# Altium schematic sheet MEMORY.SchDoc
size A3; Author: HamidFijani; DrawnBy: HamidFijani; SheetNumber: 8; SheetTotal: 13
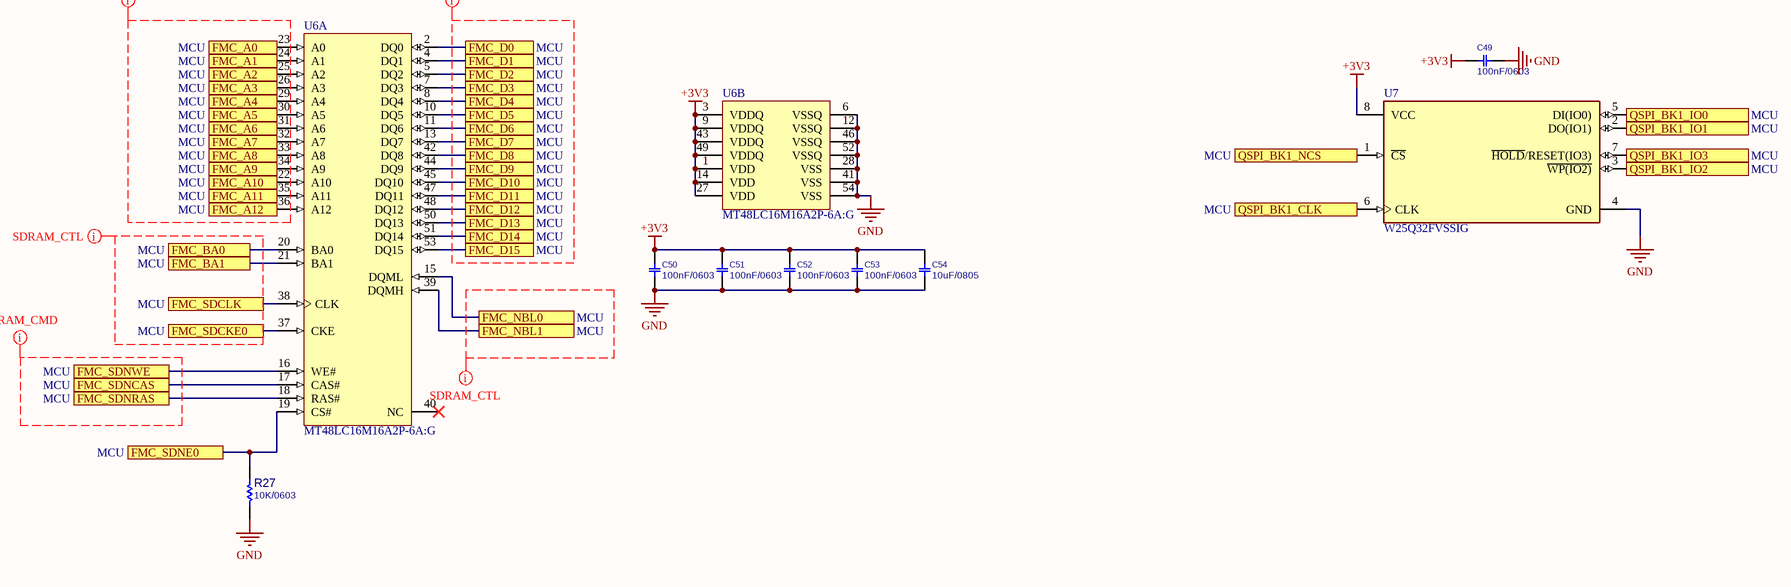
[diagram p0: MEMORY.SchDoc]

## Parts
?  (no value)  (graphical)
C49  100nF/0603  [C0603]
C50  100nF/0603  [C0603]
C51  100nF/0603  [C0603]
C52  100nF/0603  [C0603]
C53  100nF/0603  [C0603]
C54  10uF/0805  [C0805]
R27  10K/0603  [R0603]
U6  MT48LC16M16A2P-6A:G  [MICT-TG-54_N]  (parts A,B of 2)
U7  W25Q32FVSSIG  [FP-SS-MFG]

## Ports
FMC_A0 (see MCU), FMC_A1 (see MCU), FMC_A2 (see MCU), FMC_A3 (see MCU), FMC_A4 (see MCU), FMC_A5 (see MCU), FMC_A6 (see MCU), FMC_A7 (see MCU), FMC_A8 (see MCU), FMC_A9 (see MCU), FMC_A10 (see MCU), FMC_A11 (see MCU), FMC_A12 (see MCU), FMC_BA0 (see MCU), FMC_BA1 (see MCU), FMC_D0 (see MCU), FMC_D1 (see MCU), FMC_D2 (see MCU), FMC_D3 (see MCU), FMC_D4 (see MCU), FMC_D5 (see MCU), FMC_D6 (see MCU), FMC_D7 (see MCU), FMC_D8 (see MCU), FMC_D9 (see MCU), FMC_D10 (see MCU), FMC_D11 (see MCU), FMC_D12 (see MCU), FMC_D13 (see MCU), FMC_D14 (see MCU), FMC_D15 (see MCU), FMC_NBL0 (see MCU), FMC_NBL1 (see MCU), FMC_SDCKE0 (see MCU), FMC_SDCLK (see MCU), FMC_SDNCAS (see MCU), FMC_SDNE0 (see MCU), FMC_SDNRAS (see MCU), FMC_SDNWE (see MCU), QSPI_BK1_CLK (see MCU), QSPI_BK1_IO0 (see MCU), QSPI_BK1_IO1 (see MCU), QSPI_BK1_IO2 (see MCU), QSPI_BK1_IO3 (see MCU), QSPI_BK1_NCS (see MCU)

## Nets
+3V3: C49.2 C50.2 C51.2 C52.2 C53.2 C54.2 U6.1(VDD) U6.3(VDDQ) U6.9(VDDQ) U6.14(VDD) U6.27(VDD) U6.43(VDDQ) U6.49(VDDQ) U7.8(VCC)
GND: C49.1 C50.1 C51.1 C52.1 C53.1 C54.1 R27.1 U6.6(VSSQ) U6.12(VSSQ) U6.28(VSS) U6.41(VSS) U6.46(VSSQ) U6.52(VSSQ) U6.54(VSS) U7.4(GND)
FMC_A0: U6.23(A0) ; port FMC_A0
FMC_A1: U6.24(A1) ; port FMC_A1
FMC_A2: U6.25(A2) ; port FMC_A2
FMC_A3: U6.26(A3) ; port FMC_A3
FMC_A4: U6.29(A4) ; port FMC_A4
FMC_A5: U6.30(A5) ; port FMC_A5
FMC_A6: U6.31(A6) ; port FMC_A6
FMC_A7: U6.32(A7) ; port FMC_A7
FMC_A8: U6.33(A8) ; port FMC_A8
FMC_A9: U6.34(A9) ; port FMC_A9
FMC_A10: U6.22(A10) ; port FMC_A10
FMC_A11: U6.35(A11) ; port FMC_A11
FMC_A12: U6.36(A12) ; port FMC_A12
FMC_BA0: U6.20(BA0) ; port FMC_BA0
FMC_BA1: U6.21(BA1) ; port FMC_BA1
FMC_D0: U6.2(DQ0) ; port FMC_D0
FMC_D1: U6.4(DQ1) ; port FMC_D1
FMC_D2: U6.5(DQ2) ; port FMC_D2
FMC_D3: U6.7(DQ3) ; port FMC_D3
FMC_D4: U6.8(DQ4) ; port FMC_D4
FMC_D5: U6.10(DQ5) ; port FMC_D5
FMC_D6: U6.11(DQ6) ; port FMC_D6
FMC_D7: U6.13(DQ7) ; port FMC_D7
FMC_D8: U6.42(DQ8) ; port FMC_D8
FMC_D9: U6.44(DQ9) ; port FMC_D9
FMC_D10: U6.45(DQ10) ; port FMC_D10
FMC_D11: U6.47(DQ11) ; port FMC_D11
FMC_D12: U6.48(DQ12) ; port FMC_D12
FMC_D13: U6.50(DQ13) ; port FMC_D13
FMC_D14: U6.51(DQ14) ; port FMC_D14
FMC_D15: U6.53(DQ15) ; port FMC_D15
FMC_NBL0: U6.15(DQML) ; port FMC_NBL0
FMC_NBL1: U6.39(DQMH) ; port FMC_NBL1
FMC_SDCKE0: U6.37(CKE) ; port FMC_SDCKE0
FMC_SDCLK: U6.38(CLK) ; port FMC_SDCLK
FMC_SDNCAS: U6.17(CAS#) ; port FMC_SDNCAS
FMC_SDNE0: R27.2 U6.19(CS#) ; port FMC_SDNE0
FMC_SDNRAS: U6.18(RAS#) ; port FMC_SDNRAS
FMC_SDNWE: U6.16(WE#) ; port FMC_SDNWE
QSPI_BK1_CLK: U7.6(CLK) ; port QSPI_BK1_CLK
QSPI_BK1_IO0: U7.5(DI(IO0)) ; port QSPI_BK1_IO0
QSPI_BK1_IO1: U7.2(DO(IO1)) ; port QSPI_BK1_IO1
QSPI_BK1_IO2: U7.3(~{WP(IO2)}) ; port QSPI_BK1_IO2
QSPI_BK1_IO3: U7.7(~{HOLD}/RESET(IO3)) ; port QSPI_BK1_IO3
QSPI_BK1_NCS: U7.1(~{CS}) ; port QSPI_BK1_NCS

Not connected (* = marked no-connect by the designer): U6 40(NC)*

## Layout directives
net class SDRAM_ADD: (no net found under the mark)
net class SDRAM_DATA: (no net found under the mark)
net class SDRAM_CMD: (no net found under the mark)
net class SDRAM_CTL: (no net found under the mark)

## Notes on the sheet
- Title:
- Page Contents:
- Variant:
- Checked by
- Size:
- Date:
- DWG NO
- Sheet
- of
- Revision:

## Library data of the parts
? = SDTitleBlock
C49-C53 = CAP_SMD_MLCC_0603: CAP, MLCC; PARAM: -, -%; MANF_P#: MANF_PART#; PARAM2: -V; PRICE: 100= 1$; MANF: -; ASSEMBLY: ASSEMBLY; VALUE: 100nF/0603
C54 = CAP_SMD_MLCC: CAP, MLCC; PARAM: C0G, 10%; DESC: CAP, MLCC, 1nF, 50V, C0G, 10%, 0402; MANF_P#: MANF_PART#; MANF: Murata; PARAM2: 50V; PRICE: 100= 1$; ASSEMBLY: ASSEMBLY; VALUE: 10uF/0805
R27 = RES_SMD_0603: RESISTOR, SMD; PARAM: 1%, 0.1W; DESC: DESCRIPTION; DIST#: MOUSER; MANF_P#: -; MANF: -; ASSEMBLY: ASSEMBLY; PRICE: -; PARAM2: -; VALUE: 10K/0603
U6 = CMP-2000-05232-1: 256 Mb PC133 SDR SDRAM, 16 Mb x 16, 3 to 3.6 V, 0 to 70 degC, 54-Pin TSOP (TG), Pb-Free; Manufacturer: Micron; Maximum Random Access Time: 6ns; Organisation: 16Mx16bit; Package Version: Rev.W, 05/2012; Minimum Operating Supply Voltage: 3V; Number of Bits per Word: 16bit; Address Bus Width: 15bit; Memory Size: 256MB; Maximum Operating Supply Voltage: 3.6V; Number of Words: 16M; Maximum Operating Temperature: +70degC; Manufacturer URL: https://www.micron.com/; Package URL: https://www.micron.com/~/media/documents/products/data-sheet/dram/256mb_sdr.pdf; Package Type: TSOP; Mounting Type: SurfaceMount; Package Reference: TG-54; Dimensions: 22.22x10.16x1.2mm; Pin Count: 54; Datasheet URL: https://www.micron.com/~/media/documents/products/data-sheet/dram/256mb_sdr.pdf; Height: 1.2mm; Length: 22.22mm; Data Bus Width: 16bit; Datasheet Version: Rev. W, 05/2015; Minimum Operating Temperature: 0degC; Package Description: 54-Pin Thin Small Outline Package, Body 10.2 x 22.3 mm, Pitch 0.8 mm; Width: 10.16mm
U7 = CMP-2000-05006-2: IC FLASH 32M SPI 104MHZ 8SOIC; Manufacturer: Winbond; Obsolete Part: true; Access Time: 7ns; Nominal Supply Current: 8-20mA; Memory Size: 32Mbits; Max Supply Voltage: 3.6V; Min Supply Voltage: 2.7V; Standoff Height: 0.05mm; Interface: SPI,Other; Package: SS; Memory Type: FLASH; Ipc Land Pattern Name: SOIC127P790X195-8; Temperature Range High: +85°C; Temperature: -40°C to +85°C; Octopart: https://octopart.com/w25q32fvssig-winbond-23896462; Manufacturer Part Number: W25Q32FVSSIG; Ambient Temperature Range Low: -40°C; Lead Free: Yes; Height: 2.16mm; Automotive: No; Device Class L2: Memory; Digikey Description: IC FLASH 32M SPI 104MHZ 8SOIC; RoHS: TRUE; Frequency: 104MHz; Ambient Temperature Range High: +85°C; ComponentLink2Description: Datasheet; Category: IC; Device Class L1: Integrated Circuits (ICs); Device Class L3: Flash; Temperature Range Low: -40°C; Footprint Url: http://www.winbond.com/resource-files/an0000009%20spiflash%20pcb%20layout%20guideline%20v2.0%2009252017.pdf?__locale=en; ComponentLink2URL: https://www.winbond.com/resource-files/w25q32fv%20revj%2006032016.pdf